# EAGLE schematic ActiveHeadphoneSMT (EAGLE 6.2)
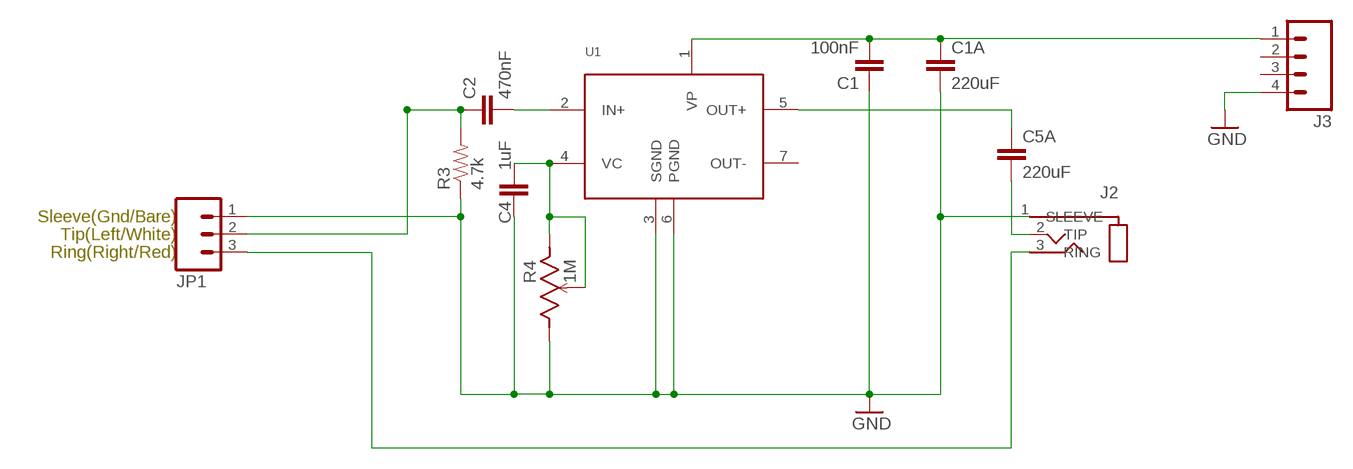
[diagram p0: schematic, sheet 1]

## Parts
C1  100nF  CAP0603-CAP  [0603-CAP]
C1A  220uF  CAPPTH1  [CAP-PTH-5MM]
C2  470nF  CAP0603-CAP  [0603-CAP]
C4  1uF  CAP0603-CAP  [0603-CAP]
C5A  220uF  CAPPTH1  [CAP-PTH-5MM]
J2  SJ1-35XXPTH  [SJ1-3523N]
J3  M04PTH  [1X04]
JP1  M03PTH  [1X03]
R3  4.7k  RESISTOR0603-RES  [0603-RES]
R4  1M  3352T  [3352T]
U1  TDA7052  [DIL-8]

## Nets
GND: C1.1 C1A.2 C4.1 J2.1(SLEEVE) J3.4 JP1.1 R3.1 R4.1(CCW) U1.3(SGND) U1.6(PGND)
N$1: C2.2 U1.2(IN+)
N$2: C2.1 JP1.2 R3.2
N$3: C5A.2 J2.2(TIP)
N$4: C4.2 R4.2(WIPER) R4.3(CW) U1.4(VC)
N$5: C1.2 C1A.1 J3.1 U1.1(VP)
N$6: C5A.1 U1.5(OUT+)
N$7: J2.3(RING) JP1.3
Unconnected: J3.2 J3.3 U1.7(OUT-)

## Notes on the sheet
- Sleeve(Gnd/Bare)
- Tip(Left/White)
- Ring(Right/Red)

## Library data of the parts
C1 C2 C4 = SparkFun-Passives:CAP: Capacitor Standard 0603 ceramic capacitor, and 0.1" leaded capacitor.
C1A C5A = SparkFun:CAP: Capacitor Standard 0603 ceramic capacitor, and 0.1" leaded capacitor.
J2 = KwanSystems:SJ1-35XX
J3 = SparkFun:M04: Header 4 Standard 4-pin 0.1" header. Use with straight break away headers (SKU : PRT-00116), right angle break away headers (PRT-00553), swiss pins (PRT-00743), machine pins (PRT-00117), and female headers (PRT-00115). Molex polarized connector foot print use with SKU : PRT-08231 with associated crimp pins and housings. 1MM SMD Version SKU: PRT-10208
JP1 = SparkFun-Connectors:M03: Header 3 Standard 3-pin 0.1" header. Use with straight break away headers (SKU : PRT-00116), right angle break away headers (PRT-00553), swiss pins (PRT-00743), machine pins (PRT-00117), and female headers (PRT-00115). Molex polarized connector foot print use with SKU : PRT-08232 with associated crimp pins and housings.
R3 = SparkFun-Passives:RESISTOR: Resistor Basic schematic elements and footprints for 0603, 1206, and PTH resistors.
R4 = KwanSystems:3352T
U1 = KwanSystems:TDA7052

## Net classes
0 default: width 0.33 mm, drill 0.33 mm, clearance 0.33 mm